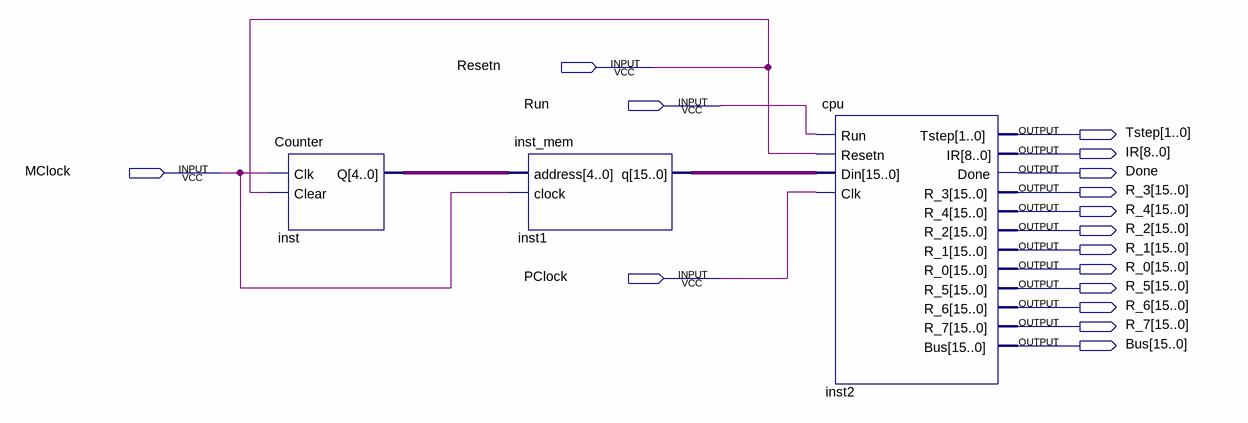
[diagram p0: schematic sheet]
// Quartus schematic part2.bdf as structural Verilog: 3 symbols, 16 pins
module part2 (
  input  Resetn,
  input  Run,
  input  MClock,
  input  PClock,
  output [1:0] Tstep,
  output [8:0] IR,
  output Done,
  output [15:0] R_3,
  output [15:0] R_4,
  output [15:0] R_2,
  output [15:0] R_1,
  output [15:0] R_0,
  output [15:0] R_5,
  output [15:0] R_6,
  output [15:0] R_7,
  output [15:0] Bus
);

  wire [4:0] inst_q;
  wire [15:0] inst1_q;

  Counter inst (.Clk(MClock), .Clear(Resetn), .Q(inst_q));
  inst_mem inst1 (.address(inst_q), .clock(MClock), .q(inst1_q));
  cpu inst2 (
    .Run(Run), .Resetn(Resetn), .Din(inst1_q), .Clk(PClock), .Tstep(Tstep), .IR(IR), .Done(Done), .R_3(R_3),
    .R_4(R_4), .R_2(R_2), .R_1(R_1), .R_0(R_0), .R_5(R_5), .R_6(R_6), .R_7(R_7), .Bus(Bus));
endmodule
